# Altium schematic sheet Driving .schdoc
size 309 x 223 mm; Symbol: Sheet-Symbol_A4; Device: Sheet-Symbol_A4; @Page Name: P1; @Create Date: 2022-11-07; @Page Count: 1; @Page No: 1; @Project Name: 2.13驱动板; @Schematic Name: Schematic1; @Update Date: 2022-11-07; Company: 佳显-辉哥; Page Size: A4; Version: V1.0
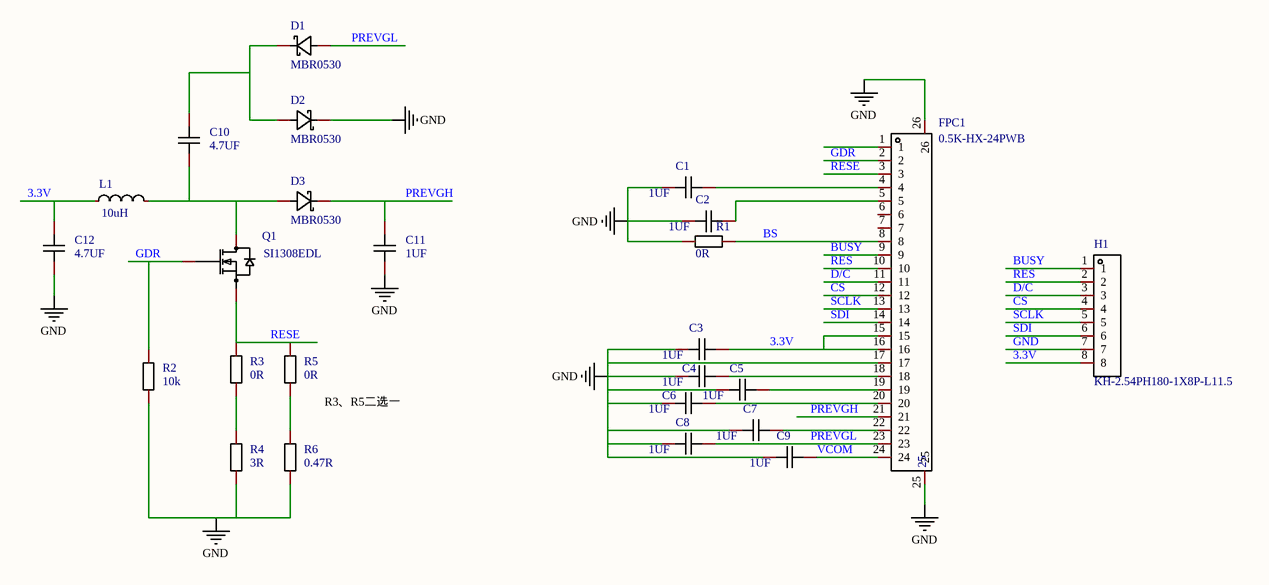
[diagram p0: Driving .schdoc]

## Parts
C1  1UF  [C0603]
C2  1UF  [C0603]
C3  1UF  [C0603]
C4  1UF  [C0603]
C5  1UF  [C0603]
C6  1UF  [C0603]
C7  1UF  [C0603]
C8  1UF  [C0603]
C9  1UF  [C0603]
C10  4.7UF  [C0603]
C11  1UF  [C0603]
C12  4.7UF  [C0603]
D1  MBR0530  [SOD-123_L2.7-W1.6-LS3.7-RD-1]
D2  MBR0530  [SOD-123_L2.7-W1.6-LS3.7-RD-1]
D3  MBR0530  [SOD-123_L2.7-W1.6-LS3.7-RD-1]
FPC1  NAME: 25  [FPC-SMD_24P-P0.50_HDGC_0.5K-HX-24PWB]  (hidden comment: 0.5K-HX-24PWB)
H1  KH-2.54PH180-1X8P-L11.5  [HDR-TH_8P-P2.54-V-M]
L1  10uH  [IND-SMD_L4.0-W4.0]
Q1  SI1308EDL  [SOT-323_L2.0-W1.3-P1.30-LS2.1-BR]
R1  0R  [R0603]
R2  10k  [R0603]
R3  0R  [R0603]
R4  3R  [R0603]
R5  0R  [R0603]
R6  0.47R  [R0603]

## Nets
GND: C1.1 C2.1 C3.1 C4.1 C5.1 C6.1 C7.1 C8.1 C9.1 C11.1 C12.1 D2.1(K) FPC1.17 FPC1.25 FPC1.26 H1.7 R1.1 R2.1 R4.1 R6.1
3.3V: C3.2 C12.2 FPC1.15 FPC1.16 H1.8 L1.1
BS: FPC1.8 R1.2
BUSY: FPC1.9 H1.1
CS: FPC1.12 H1.4
D/C: FPC1.11 H1.3
GDR: FPC1.2 Q1.1(G) R2.2
PREVGH: C11.2 D3.1(K) FPC1.21
PREVGL: C8.2 D1.2(A) FPC1.23
RES: FPC1.10 H1.2
RESE: FPC1.3 Q1.2(S) R3.2 R5.2
SCLK: FPC1.13 H1.5
SDI: FPC1.14 H1.6
VCOM: C9.2 FPC1.24
NetC1_2: C1.2 FPC1.4
NetC2_2: C2.2 FPC1.5
NetC4_2: C4.2 FPC1.18
NetC5_2: C5.2 FPC1.19
NetC6_2: C6.2 FPC1.20
NetC7_2: C7.2 FPC1.22
NetC10_1: C10.1 D3.2(A) L1.2 Q1.3(D)
NetC10_2: C10.2 D1.1(K) D2.2(A)
NetR3_1: R3.1 R4.2
NetR5_1: R5.1 R6.2

Not connected (* = marked no-connect by the designer): FPC1 1 6 7

## Notes on the sheet
- R3、R5二选一
- 1
- 2
- 3
- 4
- 5
- 6
- A
- B
- C
- Schematic
- Schematic1
- Create Date
- Update Date
- 2022-11-07
- Reviewed
- Drawed
- Page
- P1
- Part Number
- 2.13驱动板
- D
- VER
- SIZE
- PAGE
- OF
- V1.0
- A4
- 佳显-辉哥

## Library data of the parts
C1-C12 = CAP_0603: Symbol: C1210X7R475K630NT; Convert to PCB: yes; Value: 100nF; Device: CAP_0603; Add into BOM: yes; Supplier Footprint: 0603
  C1-C9 C11: Name: 1UF
  C10 C12: Name: 4.7UF
D1-D3 = MBR0530_C699108: 直流反向耐压(Vr):30V;平均整流电流(Io):500mA;正向压降(Vf):550mV@500mA;; Manufacturer: YANGJIE(扬杰); Add into BOM: yes; Reverse Voltage (Vr): 30V; Average Rectified Current (Io): 500mA; Name: MBR0530; Symbol: MBR0530_C699108; Device: MBR0530_C699108; LCSC Part Name: 30V 500mA 550mV@500mA; Supplier Part: C699108; Manufacturer Part: MBR0530; Supplier Footprint: SOD-123; JLCPCB Part Class: Extended Part; Datasheet: https://atta.szlcsc.com/upload/public/pdf/source/20200709/C699108_94C8F1A54679DD603C9696C8694A3BC2.pdf; Supplier: LCSC; Convert to PCB: yes; Forward Voltage (Vf@If): 550mV@500mA
FPC1 = 0.5K-HX-24PWB: 间距:0.5mm;触点数量:24;锁定特性:翻盖式;安装类型:卧贴;触点类型:双侧触点/上下接;工作温度范围:-55~+85;; Manufacturer: HDGC(华德共创); Add into BOM: yes; Pitch: 0.5mm; Number of Contacts: 24; Locking Feature: 翻盖式; FFC, FCB Thickness: 0.3mm; Name: 0.5K-HX-24PWB; Symbol: 0.5K-HX-24PWB; Device: 0.5K-HX-24PWB; LCSC Part Name: 0.5mm P数:24 翻盖式 双侧触点/上下接 前插后掀盖式; Supplier Part: C2919499; Manufacturer Part: 0.5K-HX-24PWB; Supplier Footprint: SMD,P=0.5mm; JLCPCB Part Class: Extended Part; Datasheet: https://atta.szlcsc.com/upload/public/pdf/source/20211115/2CE54BFA88E8212E4957B08411109FCD.pdf; Supplier: LCSC; Convert to PCB: yes; Mounting Type: 卧贴; Contact Type: 双侧触点/上下接; Height Above Board: 1mm; Operating Temperature Range: -55~+85
H1 = KH-2.54PH180-1X8P-L11.5: 间距:2.54mm;总PIN位数:8;排数:1;插针结构:1x8P;行距:-;安装类型:直插;圆针/方针:方针;额定电流:3A;额定电压:-;配合针长度:6mm;塑高:2.5mm;端接针长度:3mm;触头材质:-;工作温度范围:-40~+105;颜色:黑色;; Manufacturer: kinghelm(金航标); Add into BOM: yes; Pitch: 2.54mm; Pin Structure: 1x8P; Circluar Pins/Square Pins: 方针; Current Rating (Max): 3A; Name: KH-2.54PH180-1X8P-L11.5; Symbol: KH-2.54PH180-1X8P-L11.5; Device: KH-2.54PH180-1X8P-L11.5; LCSC Part Name: 2.54mm 1x8P 直插 方针; Supplier Part: C2905487; Manufacturer Part: KH-2.54PH180-1X8P-L11.5; Supplier Footprint: 插件,P=2.54mm; JLCPCB Part Class: Extended Part; Datasheet: https://atta.szlcsc.com/upload/public/pdf/source/20211019/E207DA256892DEA6FC546F48FC628120.pdf; Supplier: LCSC; Convert to PCB: yes; Number of Pins: 8; Number of Rows: 1; Row Spacing: -; Mounting Type: 直插; Voltage Rating (Max): -; Length of Mating Pin: 6mm; Insulation Height: 2.5mm; Length of End Connection Pin: 3mm; Contact Material: -; Operating Temperature Range: -40~+105; Color: 黑色
L1 = YNR4026-100M: 电感值:10uH;精度:±20%;额定电流:1A;直流电阻(DCR):85mΩ;; Manufacturer: YJYCOIN(益嘉源); Add into BOM: yes; Tolerance: ±20%; Rated Current: 1A; DC Resistance (DCR): 85mΩ; Name: 10uH; Symbol: YNR4026-100M; Device: YNR4026-100M; LCSC Part Name: 10uH ±20% 1A 85mΩ; Supplier Part: C497803; Manufacturer Part: YNR4026-100M; Supplier Footprint: SMD,4x4x2.6mm; JLCPCB Part Class: Extended Part; Datasheet: https://atta.szlcsc.com/upload/public/pdf/source/20200317/C497798_AEDC05463ADD96A285E93ED663237743.pdf; Supplier: LCSC; Convert to PCB: yes; Value: 10uH
Q1 = SI1308EDL: 类型:N沟道;漏源电压(Vdss):20V;连续漏极电流(Id):4A;导通电阻(RDS(on)@Vgs,Id):36mΩ@10V,4A;; Manufacturer: VBsemi(微碧); Add into BOM: yes; Type: N沟道; Drain Source Voltage (Vdss): 20V; Name: SI1308EDL; Symbol: SI1308EDL; Device: SI1308EDL; LCSC Part Name: N沟道 20V 4A; Supplier Part: C4355112; Manufacturer Part: SI1308EDL; Supplier Footprint: SC70-3; JLCPCB Part Class: Extended Part; Datasheet: https://atta.szlcsc.com/upload/public/pdf/source/20220712/F86E3BB2906D071183C948CFEAB36F2B.pdf; Supplier: LCSC; Convert to PCB: yes; Continuous Drain Current (Id): 4A; Drain Source On Resistance (RDS(on)@Vgs,Id): 36mΩ@10V,4A
R1 R3-R6 = Res_0603: Symbol: 电阻; Convert to PCB: yes; Value: 10K; Device: Res_0603; Add into BOM: yes; Supplier Footprint: 0603
  R1 R3 R5: Name: 0R
  R4: Name: 3R
  R6: Name: 0.47R
R2 = Res_0603: Symbol: 电阻; Convert to PCB: yes; Name: 10k; Device: Res_0603; Add into BOM: yes; Supplier Footprint: 0603; Value: 10K